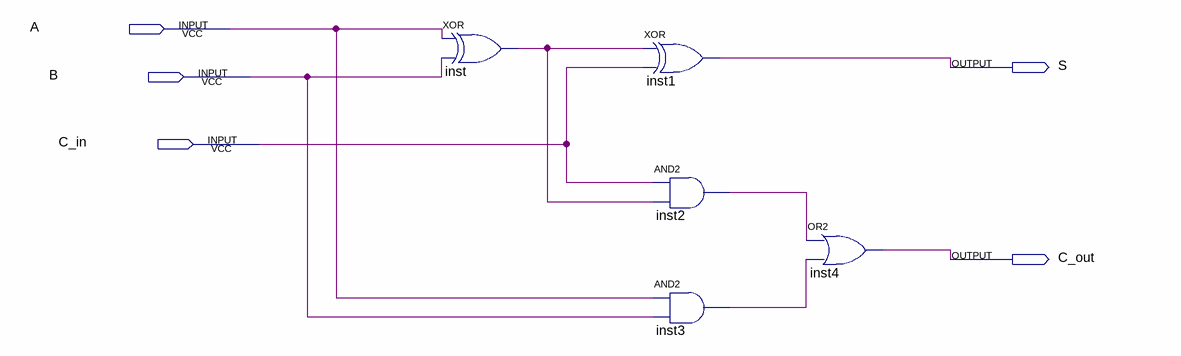
[diagram p0: schematic sheet]
// Quartus schematic full_adder_1.bdf as structural Verilog: 5 symbols, 5 pins
module full_adder_1 (
  input  A,
  input  B,
  input  C_in,
  output S,
  output C_out
);

  wire inst2_out, inst3_out, inst_out;

  xor inst (inst_out, A, B);
  xor inst1 (S, inst_out, C_in);
  and inst2 (inst2_out, C_in, inst_out);
  and inst3 (inst3_out, A, B);
  or inst4 (C_out, inst2_out, inst3_out);
endmodule
